# Altium schematic sheet Sheet_电机驱动.schdoc
size 252 x 182 mm
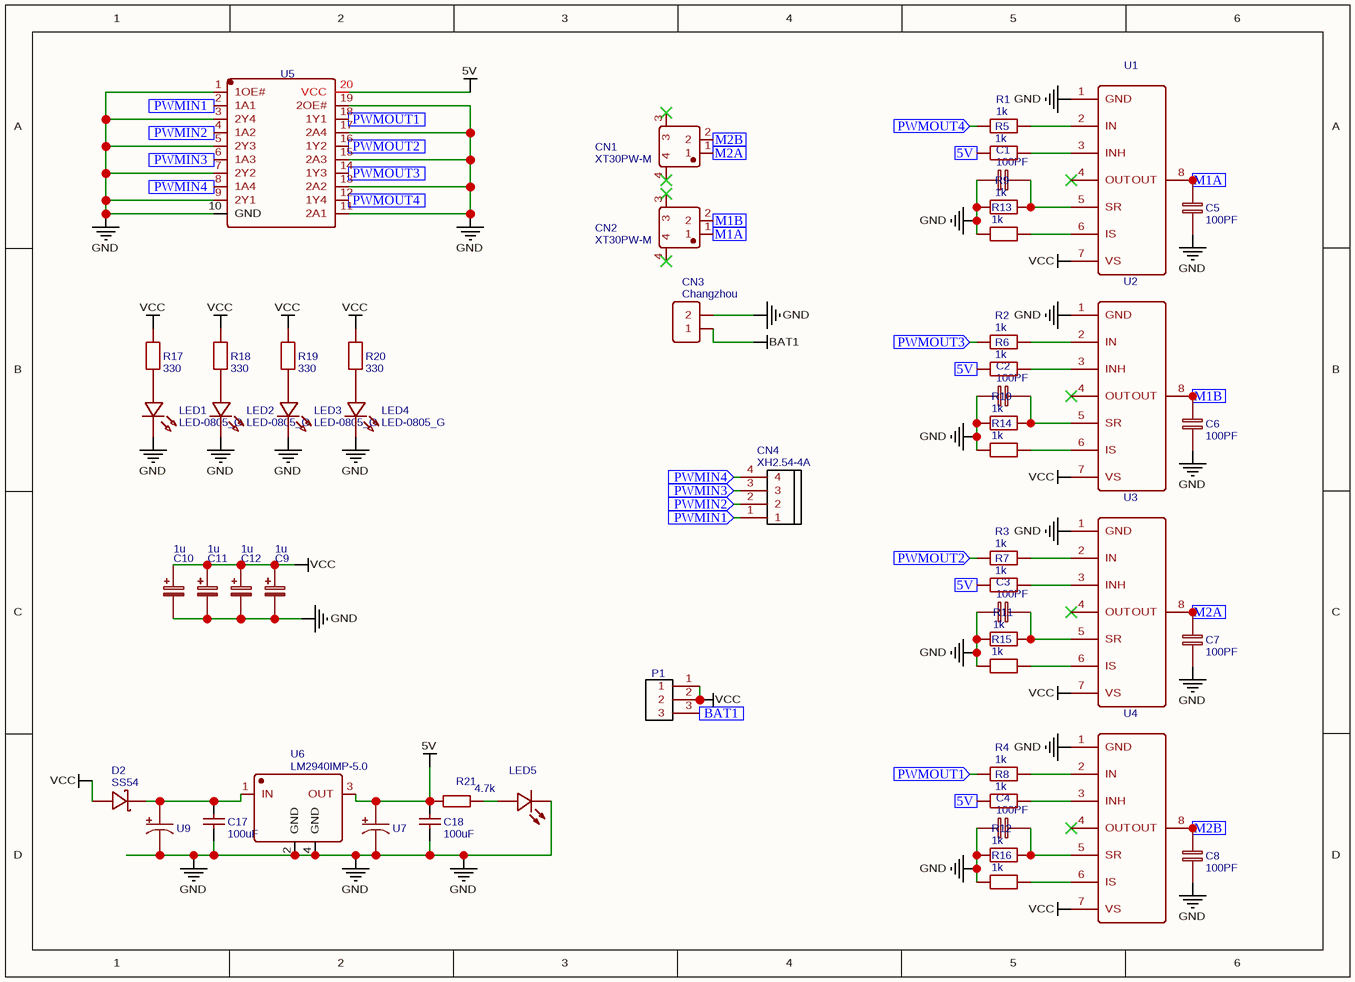
[diagram p0: Sheet_电机驱动.schdoc]

## Parts
C1  100PF  [C0805]
C2  100PF  [C0805]
C3  100PF  [C0805]
C4  100PF  [C0805]
C5  100PF  [C0805]
C6  100PF  [C0805]
C7  100PF  [C0805]
C8  100PF  [C0805]
C9  1u  [CASE-A_3216]
C10  1u  [CASE-A_3216]
C11  1u  [CASE-A_3216]
C12  1u  [CASE-A_3216]
C17  100uF  [C0805]
C18  100uF  [C0805]
CN1  XT30PW-M  [CONN-TH_XT30PW-M]
CN2  XT30PW-M  [CONN-TH_XT30PW-M]
CN3  Changzhou  [CONN-TH_XT30UPB-F]
CN4  XH2.54-4A  [XH2.54-4A]
D2  SS54  [SMB_L4.6-W3.6-LS5.3-R-RD]
LED1  LED-0805_G  [LED0805_GREEN]
LED2  LED-0805_G  [LED0805_GREEN]
LED3  LED-0805_G  [LED0805_GREEN]
LED4  LED-0805_G  [LED0805_GREEN]
LED5  E6C0805UR  [LED0805-R-RD]  (value not drawn)
P1  钮子开关  [钮子开关 MTS-102]  (value not drawn)
R1  1k  [R0805]
R2  1k  [R0805]
R3  1k  [R0805]
R4  1k  [R0805]
R5  1k  [R0805]
R6  1k  [R0805]
R7  1k  [R0805]
R8  1k  [R0805]
R9  1k  [R0805]
R10  1k  [R0805]
R11  1k  [R0805]
R12  1k  [R0805]
R13  1k  [R0805]
R14  1k  [R0805]
R15  1k  [R0805]
R16  1k  [R0805]
R17  330  [R0805]
R18  330  [R0805]
R19  330  [R0805]
R20  330  [R0805]
R21  4.7k  [R0805]
U1  BTN8962TAAUMA1  [TO-263-7_L10.2-W10.4-P1.27-LS14.4-B]  (value not drawn)
U2  BTN8962TAAUMA1  [TO-263-7_L10.2-W10.4-P1.27-LS14.4-B]  (value not drawn)
U3  BTN8962TAAUMA1  [TO-263-7_L10.2-W10.4-P1.27-LS14.4-B]  (value not drawn)
U4  BTN8962TAAUMA1  [TO-263-7_L10.2-W10.4-P1.27-LS14.4-B]  (value not drawn)
U5  SN74ALS244CNSR  [SOIC-20_L13.3-W5.5-P1.27-LS7.8-BL]  (value not drawn)
U6  LM2940IMP-5.0  [SOT-223-4_L6.5-W3.5-P2.30-LS7.0-BR]
U7  220uf16V  [CAP-SMD_BD6.3-L6.6-W6.6-LS7.6-FD]  (value not drawn)
U9  100uf25V  [CAP-SMD_BD6.3-L6.6-W6.6-LS7.6-FD]  (value not drawn)

## Ports
5V (in), BAT1 (in), M1A (in), M1B (in), M2A (in), M2B (in), PWMIN1 (in), PWMIN2 (in), PWMIN3 (in), PWMIN4 (in), PWMOUT1 (in), PWMOUT2 (in), PWMOUT3 (in), PWMOUT4 (in)

## Nets
5V: C18.2 R21.1 U5.20(VCC) U6.3(OUT) U7.1
BAT1: CN3.1
GND: C1.1 C2.1 C3.1 C4.1 C5.1 C6.1 C7.1 C8.1 C9.2 C10.2 C11.2 C12.2 C17.1 C18.1 CN3.2 LED1.2 LED2.2 LED3.2 LED4.2 LED5.2(K) R9.1 R10.1 R11.1 R12.1 R13.1 R14.1 R15.1 R16.1 U1.1(GND) U2.1(GND) U3.1(GND) U4.1(GND) U5.1(1OE#) U5.3(2Y4) U5.5(2Y3) U5.7(2Y2) U5.9(2Y1) U5.10(GND) U5.11(2A1) U5.13(2A2) U5.15(2A3) U5.17(2A4) U5.19(2OE#) U6.2(GND) U6.4(GND) U7.2 U9.2
VCC: C9.1 C10.1 C11.1 C12.1 D2.1(A) P1.1 P1.2 R17.2 R18.2 R19.2 R20.2 U1.7(VS) U2.7(VS) U3.7(VS) U4.7(VS)
5V: R5.1 R6.1 R7.1 R8.1 ; port 5V  [a separate net that carries the same name]
BAT1: P1.3 ; port BAT1  [a separate net that carries the same name]
M1A: C5.2 CN2.1 U1.8(OUT) ; port M1A
M1B: C6.2 CN2.2 U2.8(OUT) ; port M1B
M2A: C7.2 CN1.1 U3.8(OUT) ; port M2A
M2B: C8.2 CN1.2 U4.8(OUT) ; port M2B
PWMIN1: CN4.1 U5.2(1A1) ; port PWMIN1
PWMIN2: CN4.2 U5.4(1A2) ; port PWMIN2
PWMIN3: CN4.3 U5.6(1A3) ; port PWMIN3
PWMIN4: CN4.4 U5.8(1A4) ; port PWMIN4
PWMOUT1: R4.1 U5.18(1Y1) ; port PWMOUT1
PWMOUT2: R3.1 U5.16(1Y2) ; port PWMOUT2
PWMOUT3: R2.1 U5.14(1Y3) ; port PWMOUT3
PWMOUT4: R1.1 U5.12(1Y4) ; port PWMOUT4
NetC1_2: C1.2 R9.2 U1.5(SR)
NetC2_2: C2.2 R10.2 U2.5(SR)
NetC3_2: C3.2 R11.2 U3.5(SR)
NetC4_2: C4.2 R12.2 U4.5(SR)
NetC17_2: C17.2 D2.2(K) U6.1(IN) U9.1
NetLED1_1: LED1.1 R17.1
NetLED2_1: LED2.1 R18.1
NetLED3_1: LED3.1 R19.1
NetLED4_1: LED4.1 R20.1
NetLED5_1: LED5.1(A) R21.2
NetR1_2: R1.2 U1.2(IN)
NetR2_2: R2.2 U2.2(IN)
NetR3_2: R3.2 U3.2(IN)
NetR4_2: R4.2 U4.2(IN)
NetR5_2: R5.2 U1.3(INH)
NetR6_2: R6.2 U2.3(INH)
NetR7_2: R7.2 U3.3(INH)
NetR8_2: R8.2 U4.3(INH)
NetR13_2: R13.2 U1.6(IS)
NetR14_2: R14.2 U2.6(IS)
NetR15_2: R15.2 U3.6(IS)
NetR16_2: R16.2 U4.6(IS)

Not connected (* = marked no-connect by the designer): CN1 3* 4*; CN2 3* 4*; U1 4(OUT)*; U2 4(OUT)*; U3 4(OUT)*; U4 4(OUT)*

## Library data of the parts
C1-C8 = 100PF: nameAlias: Value(F); spicePre: C; spiceSymbolName: Cap_0603_EU
C9-C12 = 1u: nameAlias: Value(F); Contributor: EasyEDA; spicePre: C; spiceSymbolName: Cap_Tantalum(SMD)_A-3216_EU
C17 C18 = 100uF: Manufacturer: MuRata; Manufacturer Part: GRM21BR60J107ME15L; nameAlias: Capacitance; Package Display: No; Supplier: LCSC; Supplier Part: C141660; JLCPCB Part Class: Extended Part; spicePre: C; spiceSymbolName: GRM21BR60J107ME15L
CN1 CN2 = XT30PW-M: Manufacturer: Changzhou Amass Elec; Contributor: LCSC; Supplier: LCSC; Supplier Part: C431092; Manufacturer Part: XT30PW-M; JLCPCB Part Class: Extended Part; spicePre: C; spiceSymbolName: XT30PW-M
CN3 = Changzhou: Manufacturer: Changzhou Amass Elec; Manufacturer Part: XT30UPB-F; nameAlias: Value; Contributor: LCSC; Supplier: LCSC; Supplier Part: C108769; JLCPCB Part Class: Extended Part; spicePre: C; spiceSymbolName: XT30UPB-F
CN4 = XH2.54-4A: Manufacturer: BOOMELE; Manufacturer Part: XH2.54-4AW; Supplier: LCSC; image: //image.lceda.cn/szlcsc/C21273.jpg; Supplier Part: C21273; spicePre: C; spiceSymbolName: XH2.54-4A
D2 = SS54: Manufacturer: MDD; Package Display: No; Supplier: LCSC; Manufacturer Part: SS54; Supplier Part: C32513; JLCPCB Part Class: Extended Part; spicePre: D; spiceSymbolName: SS54
LED1-LED4 = LED-0805_G: Manufacturer: 国星光电; Manufacturer Part: NCD0805G1; Contributor: LCEDA_Lib; Supplier Part: C84260; spicePre: L; spiceSymbolName: LED-0805_G
LED5 = E6C0805UR: Manufacturer: KENTO; Package Display: No; Supplier: LCSC; Manufacturer Part: E6C0805UR; Supplier Part: C2295; spicePre: L; spiceSymbolName: E6C0805UR
P1 = 钮子开关: Contributor: marlonarnold; Supplier: 无; spicePre: U; spiceSymbolName: 钮子开关
R1-R16 = 1k: nameAlias: Value(Ω); spicePre: R; spiceSymbolName: Res_AXIAL-0.4(1/4W)_EU
R17-R20 = 330: nameAlias: Value(Ω); spicePre: R; spiceSymbolName: Res_0603(1/10W)_EU
R21 = 4.7k: Manufacturer: Tyohm; Manufacturer Part: RMC08054.7K5%N; nameAlias: Resistance; Contributor: LCSC; Package Display: No; Supplier: LCSC; Supplier Part: C269733; Resistance (Ohms): 4.7K; JLCPCB Part Class: Extended Part; spicePre: R; spiceSymbolName: RMC08054.7K5%N
U1-U4 = BTN8962TAAUMA1: Manufacturer: Infineon; Supplier: LCSC; Manufacturer Part: BTN8962TAAUMA1; Supplier Part: C112630; spicePre: U; spiceSymbolName: BTN8962TAAUMA1
U5 = SN74ALS244CNSR: Manufacturer: TI; SMT Type: Extend; Supplier: LCSC; Manufacturer Part: SN74ALS244CNSR; image: //image.lceda.cn/szlcsc/C7497.jpg; Supplier Part: C7497; LCSC Assembly: Yes; spicePre: U; spiceSymbolName: SN74ALS244CNSR
U6 = LM2940IMP-5.0: Manufacturer: TI; Contributor: sunqian; spicePre: X; Supplier: LCSC; Manufacturer Part: LM2940IMP-5.0; Supplier Part: C13991; JLCPCB Part Class: Extended Part; spiceSymbolName: LM2940IMP-5.0
U7 = 220uf16V: Manufacturer: null; Manufacturer Part: 铝电容-6.3*7.7-330uF/6.3V; Contributor: LCSC; Package Display: No; Supplier: LCSC; Supplier Part: C9900001719; JLCPCB Part Class: Extended Part; spicePre: U; spiceSymbolName: 铝电容-6.3*7.7-330UF/6.3V
U9 = 100uf25V: Manufacturer: null; Manufacturer Part: 铝电容-6.3*7.7-330uF/6.3V; Contributor: LCSC; Package Display: No; Supplier: LCSC; Supplier Part: C9900001719; JLCPCB Part Class: Extended Part; spicePre: U; spiceSymbolName: 铝电容-6.3*7.7-330UF/6.3V